# EAGLE board zx81 (EAGLE 7.6.0), part 1 of 9
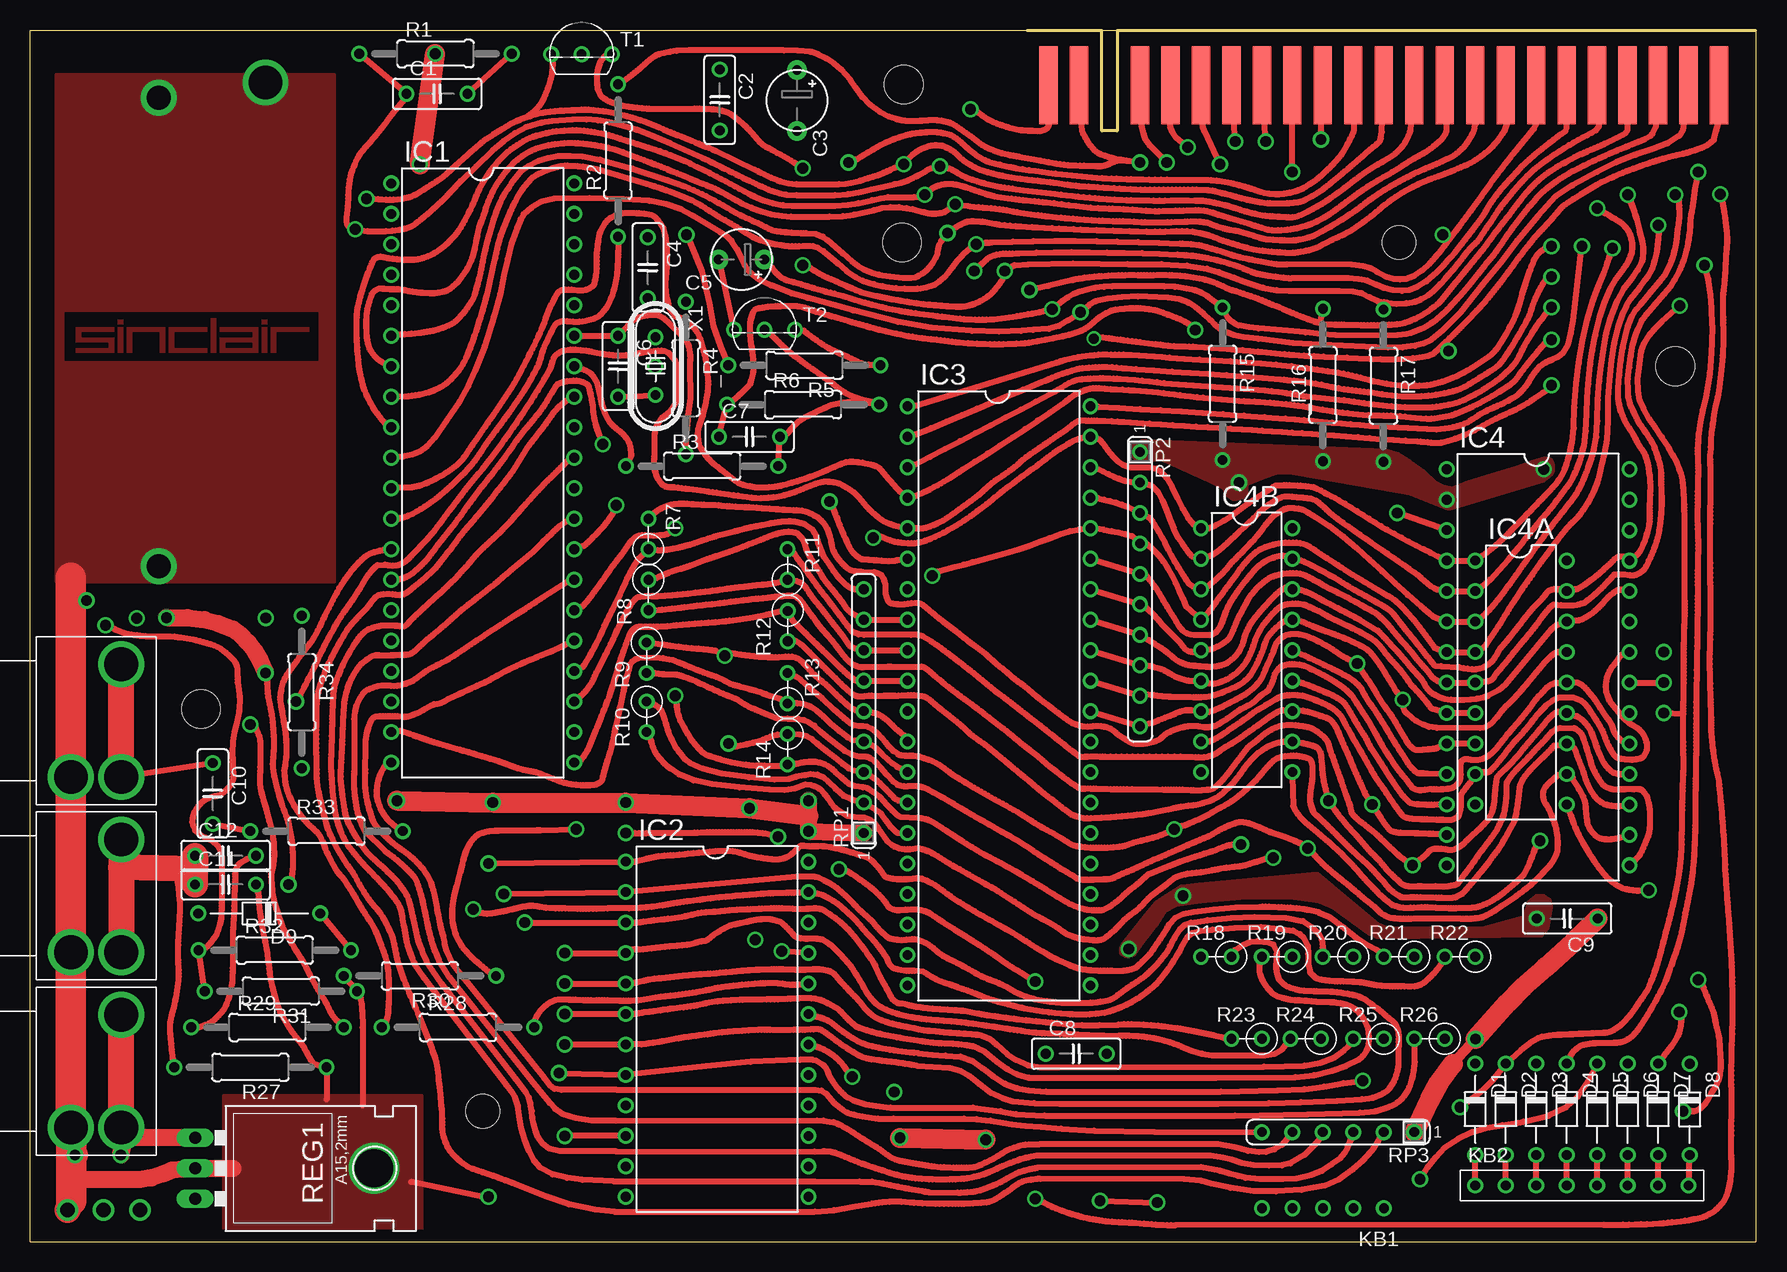
[diagram p1: board, top side]
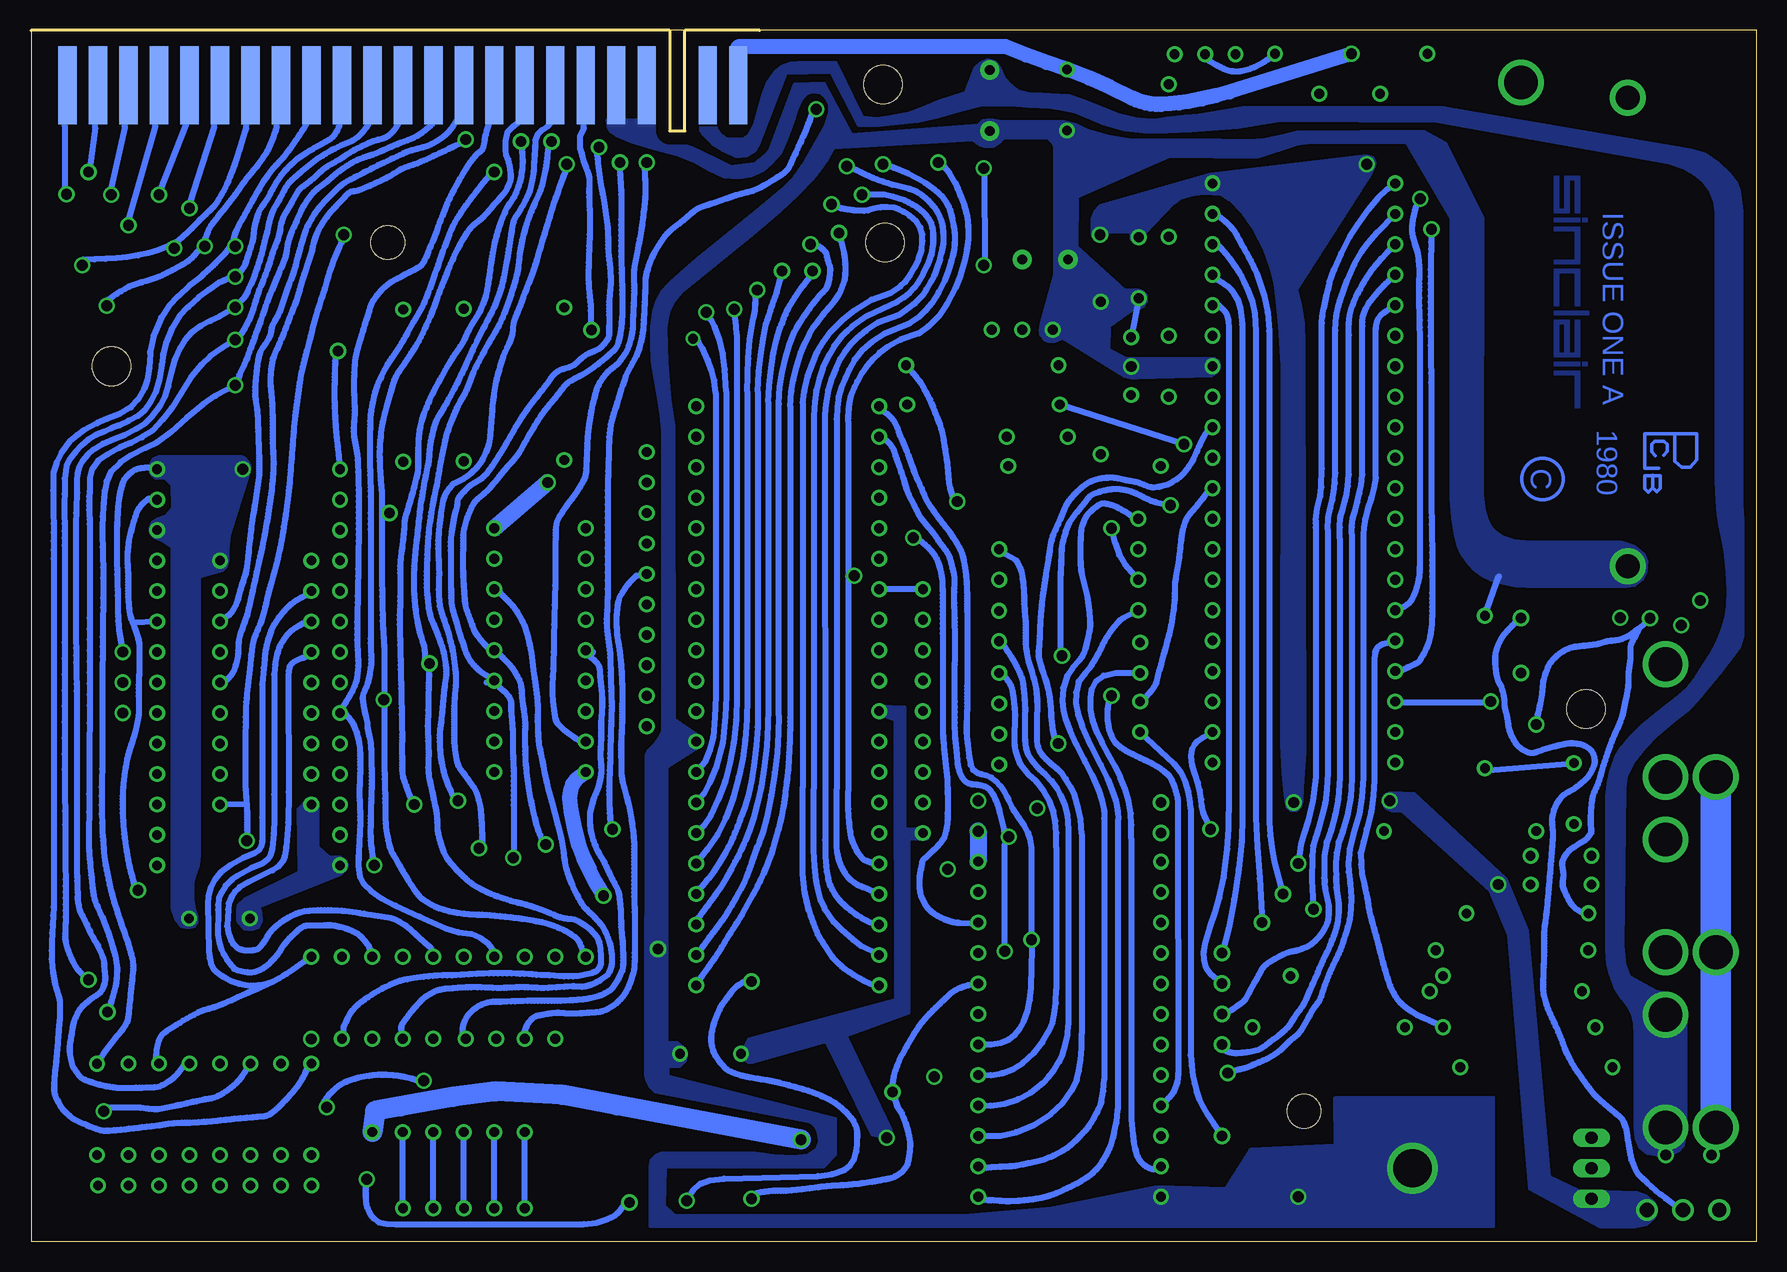
[diagram p2: board, bottom side, seen from below]

Size 143.89 x 100.97 mm. Coordinates in mm from the lower left corner, seen from the top.
Outline: 143.89,100.97 0,100.97 0,0 143.8,0 143.8,100.96
Copper layers (1*16): Top 0.035mm / dielectric 1.5mm / Bottom 0.035mm
Design rules "default *": minimum track width 10mil, minimum drill 24mil, track to track 8mil, track to pad 8mil, pad to pad 8mil, via to via 8mil, smd to smd 8mil, copper to edge 40mil, drill to drill 8mil, minimum pad ring 10mil, minimum via ring 8mil, stop-mask expansion 4mil, vias tented up to drill 0mil, thermal gap 10mil
Holes 3.2 mm at 14.23,44.37 72.81,96.44 72.66,83.27 137.11,72.95
Holes 2.8 mm at 114.09,83.27 37.73,10.88
tRestrict: 4 lines

## Footprints (pad centres in the part's own frame; a part is rotated, then mirrored left to right if it is on the bottom)
R207/12 = drill 0.813: 1 -6.35,0; 2 6.35,0
C025-025X050 = drill 0.813: 1 -2.54,0; 2 2.54,0
E5-5 = drill 0.813 pad 1.6: + -2.54,0; - 2.54,0
E3,8-5 = drill 0.813 pad 1.6: + -1.905,0; - 1.905,0
D10 = drill 0.813: A 3.81,0; C -3.81,0
D15 = drill 0.813: A 5.08,0; C -5.08,0
DIL40 = drill 0.813: 1 -7.62,24.13; 2 -7.62,21.59; 3 -7.62,19.05; 4 -7.62,16.51; 5 -7.62,13.97; 6 -7.62,11.43; 7 -7.62,8.89; 8 -7.62,6.35; 9 -7.62,3.81; 10 -7.62,1.27; 11 -7.62,-1.27; 12 -7.62,-3.81; 13 -7.62,-6.35; 14 -7.62,-8.89; 15 -7.62,-11.43; 16 -7.62,-13.97; 17 -7.62,-16.51; 18 -7.62,-19.05; 19 -7.62,-21.59; 20 -7.62,-24.13; 21 7.62,-24.13; 22 7.62,-21.59; 23 7.62,-19.05; 24 7.62,-16.51; 25 7.62,-13.97; 26 7.62,-11.43; 27 7.62,-8.89; 28 7.62,-6.35; 29 7.62,-3.81; 30 7.62,-1.27; 31 7.62,1.27; 32 7.62,3.81; 33 7.62,6.35; 34 7.62,8.89; 35 7.62,11.43; 36 7.62,13.97; 37 7.62,16.51; 38 7.62,19.05; 39 7.62,21.59; 40 7.62,24.13
DIL24 = drill 0.813: 1 -7.62,13.97; 2 -7.62,11.43; 3 -7.62,8.89; 4 -7.62,6.35; 5 -7.62,3.81; 6 -7.62,1.27; 7 -7.62,-1.27; 8 -7.62,-3.81; 9 -7.62,-6.35; 10 -7.62,-8.89; 11 -7.62,-11.43; 12 -7.62,-13.97; 13 7.62,-13.97; 14 7.62,-11.43; 15 7.62,-8.89; 16 7.62,-6.35; 17 7.62,-3.81; 18 7.62,-1.27; 19 7.62,1.27; 20 7.62,3.81; 21 7.62,6.35; 22 7.62,8.89; 23 7.62,11.43; 24 7.62,13.97
DIL28 = drill 0.813: 1 -7.62,13.97; 2 -7.62,11.43; 3 -7.62,8.89; 4 -7.62,6.35; 5 -7.62,3.81; 6 -7.62,1.27; 7 -7.62,-1.27; 8 -7.62,-3.81; 9 -7.62,-6.35; 10 -7.62,-8.89; 11 -7.62,-11.43; 12 -7.62,-13.97; 13 -7.62,-16.51; 14 -7.62,-19.05; 15 7.62,-19.05; 16 7.62,-16.51; 17 7.62,-13.97; 18 7.62,-11.43; 19 7.62,-8.89; 20 7.62,-6.35; 21 7.62,-3.81; 22 7.62,-1.27; 23 7.62,1.27; 24 7.62,3.81; 25 7.62,6.35; 26 7.62,8.89; 27 7.62,11.43; 28 7.62,13.97
DIL18 = drill 0.813: 1 -3.81,10.16; 2 -3.81,7.62; 3 -3.81,5.08; 4 -3.81,2.54; 5 -3.81,0; 6 -3.81,-2.54; 7 -3.81,-5.08; 8 -3.81,-7.62; 9 -3.81,-10.16; 10 3.81,-10.16; 11 3.81,-7.62; 12 3.81,-5.08; 13 3.81,-2.54; 14 3.81,0; 15 3.81,2.54; 16 3.81,5.08; 17 3.81,7.62; 18 3.81,10.16
ZX81CON = smd 1.524 x 6.477: A1 -27.94,-2.54; A2 -25.4,-2.54; A4 -20.32,-2.54; A5 -17.78,-2.54; A6 -15.24,-2.54; A7 -12.7,-2.54; A8 -10.16,-2.54; A9 -7.62,-2.54; A10 -5.08,-2.54; A11 -2.54,-2.54; A12 0,-2.54; A13 2.54,-2.54; A14 5.08,-2.54; A15 7.62,-2.54; A16 10.16,-2.54; A17 12.7,-2.54; A18 15.24,-2.54; A19 17.78,-2.54; A20 20.32,-2.54; A21 22.86,-2.54; A22 25.4,-2.54; A23 27.94,-2.54 | smd 1.524 x 6.477 bottom: B1 -27.94,-2.54; B2 -25.4,-2.54; B4 -20.32,-2.54; B5 -17.78,-2.54; B6 -15.24,-2.54; B7 -12.7,-2.54; B8 -10.16,-2.54; B9 -7.62,-2.54; B10 -5.08,-2.54; B11 -2.54,-2.54; B12 0,-2.54; B13 2.54,-2.54; B14 5.08,-2.54; B15 7.62,-2.54; B16 10.16,-2.54; B17 12.7,-2.54; B18 15.24,-2.54; B19 17.78,-2.54; B20 20.32,-2.54; B21 22.86,-2.54; B22 25.4,-2.54; B23 27.94,-2.54
ZXKLINKE = drill 2.8: 1 2.1,-4.7; 1' 2.1,4.7; 2 -2.1,-4.7
ZXKDB5 = drill 0.8: P$1 -5.08,0; P$2 -2.54,0; P$3 0,0; P$4 2.54,0; P$5 5.08,0
ZXKBD8 = drill 0.8: P$1 -8.89,0; P$2 -6.35,0; P$3 -3.81,0; P$4 -1.27,0; P$5 1.27,0; P$6 3.81,0; P$7 6.35,0; P$8 8.89,0
RV = drill 0.813: 1 -1.27,0; 2 1.27,0
78XXL = drill 1.016 long: GND 0,0; IN -2.54,0; OUT 2.54,0
SIL9 = drill 0.813: 1 -10.16,0; 2 -7.62,0; 3 -5.08,0; 4 -2.54,0; 5 0,0; 6 2.54,0; 7 5.08,0; 8 7.62,0; 9 10.16,0
SIL10 = drill 0.813: 1 -11.43,0; 2 -8.89,0; 3 -6.35,0; 4 -3.81,0; 5 -1.27,0; 6 1.27,0; 7 3.81,0; 8 6.35,0; 9 8.89,0; 10 11.43,0
SIL6 = drill 0.813: 1 -6.35,0; 2 -3.81,0; 3 -1.27,0; 4 1.27,0; 5 3.81,0; 6 6.35,0
TO92FLAT = drill 0.813: 1 0,0; 2 2.54,0; 3 -2.54,0
HC49 = drill 0.813: 1 -2.413,0; 2 2.413,0

## Placement (x,y rotation side)
_R4  18k  [R207/12]  54.66,71.97 270 top
_R16  [R207/12]  107.75,71.39 90 top
C1  47p  [C025-025X050]  33.92,95.65 0 top
C2  100n  [C025-025X050]  57.47,95.14 270 top
C3  22µ/16V  [E5-5]  63.92,95.1 270 top
C4  100n  [C025-025X050]  51.49,81.16 270 top
C5  1µ  [E3,8-5]  59.29,81.84 180 top
C6  [C025-025X050]  49,72.95 270 top
C7  47p  [C025-025X050]  59.95,67.07 0 top
C8  100n  [C025-025X050]  87.18,15.66 0 top
C9  100n  [C025-025X050]  128.1,26.93 180 top
C10  10n  [C025-025X050]  15.23,37.34 270 top
C11  47n  [C025-025X050]  16.3,29.77 0 top
C12  47p  [C025-025X050]  16.3,32.15 0 top
D1  [D10]  120.44,11.03 270 top
D2  [D10]  122.98,11.03 270 top
D3  [D10]  125.52,11.03 270 top
D4  [D10]  128.06,11.03 270 top
D5  [D10]  130.6,11.03 270 top
D6  [D10]  133.14,11.03 270 top
D7  [D10]  135.68,11.03 270 top
D8  [D10]  138.31,11.02 270 top
D9  [D15]  19.1,27.35 180 top
IC1  ZX81ULA  [DIL40]  37.73,64.06 0 top
IC2  2764  [DIL24]  57.26,17.7 0 top
IC3  Z80CPU  [DIL40]  80.75,45.48 0 top
IC4  4816  [DIL28]  125.68,50.4 0 top
IC4A  2114  [DIL18]  124.25,46.59 0 top
IC4B  2114  [DIL18]  101.39,49.29 0 top
K1  ZX81CONN  [ZX81CON]  112.81,98.9 0 top
K2  MIC  [ZXKLINKE]  5.5,28.81 0 top
K3  EAR  [ZXKLINKE]  5.5,43.42 0 top
K4  DCIN  [ZXKLINKE]  5.5,14.21 0 top
KB1  ZXKBD5CON  [ZXKDB5]  107.74,2.78 180 top
KB2  ZXKBD8CON  [ZXKBD8]  129.33,4.68 0 top
R1  10k  [R207/12]  33.79,98.99 0 top
R2  680  [R207/12]  49,90.09 90 top
R3  not used  [R207/12]  56.01,64.63 0 top
R5  330  [R207/12]  64.53,73.03 180 top
R6  2k2  [R207/12]  64.43,69.76 0 top
R7  470  [RV]  51.54,58.98 270 top
R8  470  [RV]  51.54,53.9 90 top
R9  470  [RV]  51.38,48.66 90 top
R10  470  [RV]  51.38,43.74 90 top
R11  470  [RV]  63.13,56.44 270 top
R12  470  [RV]  63.14,51.29 90 top
R13  470  [RV]  63.13,46.12 270 top
R14  470  [RV]  63.13,41.04 90 top
R15  220k  [R207/12]  99.38,71.49 270 top
R17  1k  [R207/12]  112.79,71.33 270 top
R18  1k  [RV]  98.85,23.73 0 top
R19  1k  [RV]  103.93,23.73 0 top
R20  1k  [RV]  109.01,23.73 0 top
R21  1k  [RV]  114.09,23.73 0 top
R22  1k  [RV]  119.17,23.73 0 top
R23  1k  [RV]  101.39,16.91 0 top
R24  1k  [RV]  106.31,16.91 0 top
R25  1k  [RV]  111.55,16.91 0 top
R26  1k  [RV]  116.63,16.91 0 top
R27  1k  [R207/12]  18.36,14.53 180 top
R28  680  [R207/12]  35.67,17.86 0 top
R29  1M  [R207/12]  19.79,17.86 0 top
R30  [R207/12]  32.49,22.15 180 top
R31  [R207/12]  20.9,20.88 180 top
R32  [R207/12]  20.39,24.29 0 top
R33  4k7  [R207/12]  24.71,34.21 0 top
R34  220  [R207/12]  22.65,45.8 270 top
REG1  7805  [78XXL]  13.76,6.11 270 top
RP1  not used  [SIL9]  69.48,44.21 90 top
RP2  10k  [SIL10]  92.5,54.37 270 top
RP3  RSIL5  [SIL6]  109.01,9.13 180 top
T1  [TO92FLAT]  45.97,98.94 0 top
T2  [TO92FLAT]  61.21,76 0 top
X1  6,5MHz  [HC49]  52.13,72.96 270 top

## Tracks (layer width: path | path; a pad name or v marks a point on that pad's centre or on a via)
+5V  (via drill 0.9, 1.2)
  Top 0.5: v54.72,83.9 55.51,82 55.99,80.88 56.3,79.46 56.62,78.19 56.94,76.28 57.57,74.53 R5.2 | v19.63,47.39 19.76,47.05 19.76,46.86 19.77,46.66 19.77,46.46 19.77,46.27 19.78,46.07 19.79,45.88 19.81,45.68 19.85,45.38 19.9,45.07 19.96,44.77 20.02,44.46 20.09,44.16 20.14,43.86 20.19,43.55 20.22,43.26 20.25,42.97 20.27,42.68 20.29,42.39 20.31,42.1 20.32,41.81 20.33,41.52 20.33,41.23 20.31,40.95 20.29,40.66 20.26,40.38 20.24,40.09 20.23,39.81 20.24,39.53 20.28,39.14 20.35,38.75 20.44,38.37 20.54,37.98 20.64,37.59 20.74,37.21 20.85,36.83 20.94,36.56 21.04,36.29 21.14,36.02 21.24,35.75 21.34,35.48 21.43,35.21 21.51,34.94 21.56,34.72 21.61,34.51 21.65,34.29 21.69,34.08 21.73,33.86 21.77,33.64 21.8,33.43 21.83,33.09 21.86,32.75 21.88,32.41 21.9,32.07 21.91,31.73 21.91,31.39 21.89,31.06 21.88,30.88 21.85,30.69 21.83,30.51 21.8,30.33 21.77,30.14 21.74,29.96 21.7,29.78 v21.54,29.77
  Top 0.813: v120.46,16.89 118.58,14.82
  Top 1.422: v64.88,36.75 64.88,35.48 v64.88,34.21 RP1.1 | v11.38,51.99 13.12,51.99 14.55,51.83 15.66,51.52 16.93,51.04 17.57,50.56 18.2,49.93 18.68,49.29 19.16,48.5 v19.63,47.39
  Top 1.676: v32.49,89.77 v33.76,98.98 | v30.59,36.75 v38.57,36.59 v49.64,36.59 v59.95,36.12 64.88,35.48 | v120.46,16.89 123.14,19.9 124.42,21.18 126.3,22.88 128.63,24.99 C9.1 | 118.58,14.82 117.41,13.24 116.62,11.77 RP3.1 | v72.5,8.65 v79.64,8.49
  Bottom 0.5: IC4.28 133.97,64.5 134.15,64.49 134.34,64.48 134.51,64.47 134.69,64.44 134.86,64.41 135.02,64.36 135.18,64.3 135.32,64.21 135.45,64.11 135.58,64 135.71,63.88 135.84,63.76 135.95,63.63 136.05,63.5 136.11,63.37 136.17,63.23 136.22,63.08 136.26,62.93 136.3,62.78 136.34,62.64 136.38,62.49 136.43,62.26 136.47,62.02 136.49,61.78 136.52,61.54 136.54,61.3 136.56,61.06 136.58,60.82 136.6,60.6 136.61,60.38 136.62,60.16 136.63,59.94 136.63,59.72 136.64,59.5 136.65,59.28 136.65,58.94 136.66,58.59 136.66,58.25 136.66,57.9 136.65,57.56 136.65,57.21 136.65,56.87 136.64,56.44 136.63,56.01 136.62,55.58 136.61,55.15 136.6,54.72 136.59,54.29 136.58,53.86 136.57,53.5 136.57,53.15 136.57,52.8 136.56,52.44 136.56,52.09 136.54,51.73 136.51,51.38 136.49,51.13 136.45,50.88 136.42,50.63 136.38,50.39 136.33,50.14 136.29,49.89 136.25,49.64 v136.16,49.13
  Bottom 1.27: v33.76,98.98 43.92,95.82 arc8 47.4,95.01 arc7 49.66,94.78 arc30 52.1,95.32 arc-8 C2.1 arc5 62.59,99.59 84.9,99.56 K1.B1
  Bottom 1.422: IC4B.18 v100.75,63.26 | v64.88,34.21 IC2.24
  Bottom 1.676: v79.64,8.49 94.95,11.35 99.55,12.22 105.08,12.52 108.62,12.07 113.03,11.28 115.14,10.9 RP3.1
  other vias: 126.15,64.37 9.15,2.62
  pour Top (no thermals): 92.97,66.75 112.98,65.96 113.93,65.64 115.04,65.01 116.15,64.22 117.11,63.26 117.74,62.94 118.53,62.79 119.8,63.26 121.87,63.9 123.93,64.53 125.2,65.01 126.31,65.33 126.79,65.17 126.95,64.69 126.95,64.22 126.79,63.9 126.15,63.42 118.22,61.04 115.04,62.31 105.99,63.9 104.88,64.06 103.93,64.06 102.98,63.74 101.39,63.1 101.39,62.31 101.07,61.99 100.28,61.83 99.8,62.15 99.48,62.79 98.21,63.42 94.72,65.01 94.25,65.17 93.61,65.17 92.66,65.17 92.18,65.17 91.86,65.49 91.7,65.8 91.7,66.12 92.02,66.44 92.66,66.75
  pour Bottom (no thermals): 73.14,44.63 70.97,44.52 70.97,34.37 69.13,34.37 69.13,33.56 70.65,33.56 70.65,19.07 75.91,17.17 72.17,9.3 72.44,8.65 73.69,8.92 77.54,16.68 83.88,14.89 84.7,15.44 83.99,16.85 71.73,20.16 71.79,43.49 73.25,43.97 73.15,44.62 72.11,44.19
  pour Bottom (no thermals): 13.72,4.19 9.99,4.08 9.19,3.79 8.58,3.29 8.38,2.66 8.53,1.98 9.17,1.44 10.17,1.24 13.02,1.22 18.93,4.43 20.65,25.58 22.22,29.22 29.58,35.89 30.41,35.89 30.89,36.13 31.1,36.57 31.1,36.94 30.84,37.28 30.41,37.41 28.56,37.31 20.91,30.22 19.1,25.89 17.29,5.43 14.81,4.23 13.74,4.21
  pour Bottom (no thermals): 32.52,90.49 45.51,88.94 54.7,86.31 55.11,85.85 55.38,85.21 55.38,83.97 55.07,83.48 54.55,83.41 54.25,83.67 54.06,84.16 52.1,84.16 52.1,83.56 51.8,83.33 51.35,83.29 51.08,83.56 51.04,83.97 48.71,86.46 47.96,86.98 47.05,87.25 46.11,87.36 44.57,87.28 43.89,86.83 42.83,85.74 41.86,84.35 40.99,82.69 40.42,81.03 40.12,79.83 39.94,78.4 39.75,76.29 39.52,72.97 39.56,41.45 39.46,39.04 39.28,37.25 39.13,36.2 38.81,35.95 38.31,35.95 38.05,36.28 37.91,36.68 37.87,37.83 37.77,39.07 37.68,40.77 37.73,74.81 37.79,76.59 38.05,78.09 38.35,79.38 32.14,89.13 31.8,89.92 31.99,90.34
  pour Bottom (no thermals): 126.24,65.41 133.15,65.39 133.61,65.2 133.87,64.72 133.89,64.33 133.8,63.98 133.43,63.67 132.6,63.63 132.04,63.04 131.99,61.12 132.58,60.45 133.15,60.23 133.72,59.9 133.87,59.44 133.82,59.07 133.52,58.7 132.93,58.44 132.02,57.85 132.04,27.78 131.69,26.83 131.28,26.3 130.73,26.15 130.21,26.28 129.99,26.59 129.99,27.11 130.21,27.72 130.32,28.52 130.32,29.96 130.1,30.7 129.86,31.36 129.77,32.16 129.79,55.39 127.83,55.94 127.59,56.2 127.4,56.74 127.4,57.64 127.27,58.92 125.68,64.09 125.59,64.61 125.72,64.96 125.98,65.28
/BUSAK  (via drill 0.9)
  Top 0.5: K1.A18 128.06,92.79 127.94,92.54 127.61,92.3 127.29,92.06 126.96,91.82 126.64,91.58 126.32,91.33 126,91.08 125.69,90.82 125.5,90.66 125.3,90.5 125.11,90.33 124.92,90.16 124.73,89.99 124.55,89.82 124.37,89.64 124.23,89.5 124.09,89.36 123.96,89.21 123.83,89.07 123.7,88.92 123.57,88.78 123.44,88.63 123.29,88.47 123.14,88.31 123,88.15 122.85,87.99 122.7,87.83 122.56,87.67 122.42,87.5 122.31,87.35 122.19,87.2 122.08,87.04 121.96,86.89 121.85,86.73 121.74,86.57 121.64,86.41 121.57,86.29 121.5,86.18 121.43,86.06 121.36,85.94 121.3,85.82 121.23,85.71 121.16,85.59 121.07,85.46 120.97,85.32 120.88,85.19 120.78,85.06 120.68,84.93 120.58,84.8 120.48,84.66 120.19,84.28 119.9,83.9 119.61,83.53 119.31,83.15 119.02,82.78 118.71,82.41 118.4,82.05 118.2,81.83 118,81.61 117.81,81.38 117.61,81.16 117.4,80.95 117.19,80.75 116.36,80.02 115.57,79.55 114.96,79.3 114.33,79.22 113.57,79.3 112.78,79.49 112.21,79.75 111.47,80.06 110.72,80.22 109.86,80.3 105.1,80.28 104.88,80.29 104.67,80.31 104.45,80.34 104.23,80.36 104.01,80.39 103.8,80.41 103.58,80.44 103.36,80.47 103.14,80.51 102.92,80.54 102.71,80.58 102.49,80.62 102.28,80.67 102.03,80.74 101.78,80.83 101.54,80.93 101.3,81.03 101.05,81.13 100.81,81.23 100.56,81.31 100.3,81.4 100.03,81.48 99.76,81.56 99.49,81.64 99.22,81.71 98.95,81.78 98.68,81.85 98.43,81.9 98.18,81.95 97.93,82 97.68,82.05 97.43,82.09 97.18,82.13 96.93,82.16 96.74,82.18 96.55,82.19 96.37,82.2 96.18,82.21 95.99,82.22 95.8,82.23 95.61,82.24 94.14,82.32 92.68,82.37 91.21,82.4 89.75,82.43 88.28,82.44 86.81,82.45 85.34,82.44 83.88,82.41 82.41,82.36 82.15,82.34 81.88,82.34 81.61,82.34 81.34,82.34 81.08,82.32 80.81,82.3 80.55,82.24 80.47,82.22 80.38,82.19 80.28,82.16 80.19,82.13 80.1,82.1 80.02,82.06 79.94,82.02 79.87,81.97 79.81,81.92 79.75,81.87 79.69,81.82 79.63,81.76 79.57,81.71 79.49,81.63 79.41,81.56 79.33,81.48 79.25,81.41 79.17,81.33 79.09,81.25 79.01,81.17 v78.69,80.88
  Bottom 0.5: v78.69,80.88 78.95,80.34 79.12,80.12 79.3,79.89 79.47,79.66 79.64,79.43 79.81,79.2 79.97,78.97 80.13,78.73 80.24,78.57 80.34,78.4 80.45,78.23 80.55,78.06 80.65,77.89 80.75,77.72 80.84,77.55 80.93,77.36 81,77.18 81.08,76.99 81.15,76.8 81.22,76.6 81.29,76.41 81.36,76.22 81.66,75.25 81.94,74 82.17,72.44 82.29,71.34 82.36,69.94 82.36,44.44 82.39,43.04 82.49,41.28 82.68,39.62 82.95,37.9 83.27,36.49 83.56,35.36 83.86,34.51 83.97,34.24 84.07,33.97 84.17,33.69 84.28,33.43 84.39,33.16 84.53,32.86 84.67,32.56 84.81,32.26 84.97,31.96 85.12,31.67 85.28,31.37 85.43,31.08 85.55,30.87 85.67,30.65 85.79,30.44 85.91,30.23 86.03,30.02 86.16,29.82 86.28,29.61 86.41,29.42 86.53,29.24 86.66,29.06 86.79,28.88 86.92,28.7 87.05,28.52 87.18,28.33 87.32,28.14 87.46,27.95 87.61,27.76 87.75,27.57 87.89,27.39 88.03,27.2 88.18,27.01 IC3.23
/BUSRQ  (via drill 0.9)
  Top 0.5: 107.46,76.56 107.34,76.6 107.23,76.63 107.11,76.67 106.97,76.72 106.82,76.77 106.68,76.82 106.53,76.87 106.39,76.93 106.24,76.98 106.1,77.03 105.82,77.14 105.53,77.26 105.25,77.38 104.97,77.5 104.69,77.61 104.41,77.73 104.13,77.85 103.83,77.97 103.54,78.09 103.24,78.22 102.94,78.34 102.65,78.46 102.35,78.58 102.05,78.69 101.74,78.8 101.43,78.91 101.12,79.01 100.81,79.11 100.5,79.21 100.19,79.3 99.88,79.4 99.64,79.51 99.41,79.62 99.17,79.73 98.93,79.83 98.69,79.93 98.44,80.02 98.19,80.1 97.95,80.16 97.71,80.22 97.46,80.27 97.22,80.32 96.97,80.36 96.72,80.4 96.48,80.44 96.26,80.46 96.04,80.48 95.83,80.5 95.61,80.51 95.39,80.53 95.17,80.54 94.96,80.55 94.69,80.56 94.43,80.56 94.16,80.56 93.9,80.56 93.63,80.55 93.37,80.55 93.1,80.55 92.84,80.55 92.58,80.55 92.32,80.55 92.05,80.55 91.79,80.56 91.53,80.55 91.27,80.55 90.99,80.54 90.71,80.53 90.43,80.52 90.14,80.51 89.86,80.5 89.58,80.49 89.3,80.47 89.1,80.45 88.9,80.43 88.7,80.41 88.5,80.4 88.3,80.37 88.09,80.35 87.89,80.32 87.74,80.3 87.58,80.28 87.42,80.26 87.26,80.23 87.11,80.2 86.95,80.17 86.8,80.13 85.92,79.91 84.89,79.65 v83.29,79.3 | 107.46,76.56 107.58,76.53 107.69,76.5 107.81,76.47 107.93,76.44 108.12,76.44 108.31,76.43 108.51,76.43 108.7,76.43 108.89,76.42 109.09,76.42 109.28,76.41 109.51,76.41 109.75,76.41 109.98,76.4 110.21,76.4 110.44,76.39 110.68,76.39 110.91,76.39 111.19,76.38 111.46,76.38 111.73,76.38 112,76.37 112.28,76.37 112.55,76.38 112.83,76.39 113.05,76.4 113.27,76.41 113.49,76.42 113.72,76.44 113.94,76.46 114.16,76.49 114.37,76.53 114.57,76.58 114.76,76.64 114.95,76.71 115.14,76.79 115.33,76.87 115.51,76.95 115.69,77.03 115.97,77.18 116.23,77.35 116.49,77.53 116.74,77.71 116.99,77.9 117.24,78.09 117.47,78.3 117.65,78.49 117.82,78.69 117.99,78.9 118.15,79.11 118.32,79.32 118.48,79.53 118.65,79.73 118.82,79.94 118.99,80.14 119.16,80.34 119.33,80.54 119.5,80.74 119.66,80.94 119.83,81.14 120.02,81.37 120.2,81.6 120.39,81.82 120.58,82.05 120.76,82.28 120.94,82.51 121.12,82.75 121.3,82.98 121.47,83.21 121.64,83.44 121.82,83.68 121.99,83.91 122.16,84.15 122.33,84.38 122.47,84.55 122.61,84.72 122.74,84.9 122.88,85.07 123.02,85.24 123.16,85.41 123.29,85.59 123.5,85.85 123.7,86.12 123.9,86.39 124.1,86.66 124.3,86.93 124.51,87.19 124.73,87.44 124.88,87.61 125.04,87.78 125.2,87.94 125.36,88.1 125.52,88.26 125.68,88.42 125.85,88.57 126.07,88.75 126.29,88.92 126.52,89.08 126.75,89.24 126.98,89.39 127.22,89.54 127.46,89.69 127.71,89.83 127.96,89.97 128.21,90.1 128.46,90.24 128.72,90.37 128.97,90.5 129.23,90.62 129.51,90.75 129.8,90.88 130.08,91 130.37,91.12 130.66,91.24 130.94,91.37 131.23,91.5 131.48,91.62 131.73,91.74 131.98,91.86 132.23,91.99 132.48,92.11 132.72,92.24 132.97,92.37 133.14,92.63 K1.A20
  Top 0.5: _R16.2 107.46,76.56
  Bottom 0.5: v83.29,79.3 83.44,78.64 83.45,78.45 83.46,78.27 83.47,78.09 83.48,77.9 83.49,77.72 83.51,77.54 83.54,77.36 83.58,77.15 83.64,76.94 83.92,75.17 84.02,73.6 84.11,70.81 84.11,45.31 84.15,43.48 84.3,41.84 84.49,40.23 84.84,38.71 85.3,37 85.91,35.29 86.6,33.94 87.45,32.7 IC3.25
/HALT  (via drill 0.9)
  Top 0.5: R1.1 C1.1 31.26,95.28 31.07,95.03 30.85,94.77 30.64,94.52 30.43,94.27 30.24,94.02 30,93.7 29.75,93.38 29.5,93.07 29.25,92.75 29,92.44 28.75,92.12 28.5,91.81 28.35,91.63 28.19,91.45 28.03,91.28 27.87,91.1 27.71,90.92 27.56,90.73 27.43,90.54 27.3,90.31 27.18,90.06 27.06,89.82 26.96,89.56 26.86,89.31 26.77,89.06 26.69,88.8 26.63,88.49 26.59,88.18 26.56,87.86 26.54,87.55 26.52,87.23 26.5,86.91 26.49,86.59 26.47,86.3 26.44,85.98 26.4,85.66 26.37,85.33 26.36,85.03 26.41,84.77 26.56,84.58 26.62,84.55 26.7,84.52 v27.09,84.38 27.59,84.27 28.1,84.21 28.63,84.19 29.15,84.19 29.68,84.21 30.2,84.25 30.71,84.32 30.83,84.34 30.96,84.36 31.09,84.39 31.21,84.42 31.34,84.44 31.46,84.48 31.58,84.52 31.78,84.62 31.98,84.74 32.17,84.87 32.36,85.02 32.55,85.16 32.73,85.31 32.92,85.45 33.16,85.65 33.39,85.86 33.62,86.07 33.85,86.28 34.07,86.5 34.3,86.71 34.52,86.93 34.76,87.16 34.98,87.4 35.21,87.64 35.44,87.89 35.66,88.13 35.89,88.37 37.17,89.61 38.54,90.92 39.47,91.71 40.43,92.38 41.35,92.87 42.61,93.24 43.51,93.38 45.2,93.5 46.36,93.52 47.32,93.44 48.27,93.28 49.19,93.03 50.56,92.65 51.8,92.16 53.39,91.51 56.04,90.32 56.33,90.19 56.56,90.08 56.79,89.97 57.02,89.85 57.25,89.74 57.48,89.62 57.71,89.5 57.94,89.39 58.23,89.24 58.52,89.1 58.81,88.96 59.1,88.81 59.39,88.67 59.68,88.53 59.97,88.39 60.23,88.27 60.49,88.15 60.75,88.03 61.01,87.91 61.27,87.79 61.53,87.68 61.79,87.56 62.46,87.36 63.01,87.25 63.87,87.2 67.1,87.2 68.15,87.29 69.25,87.47 70.09,87.68 71.11,87.9 72.02,88.12 72.58,88.24 73.2,88.46 73.4,88.56 73.59,88.65 73.78,88.75 73.97,88.84 74.17,88.94 74.35,89.03 74.52,89.13 74.7,89.24 74.87,89.35 75.05,89.45 75.23,89.53 v75.83,89.62 76.29,89.51 76.4,89.48 76.52,89.45 76.63,89.41 76.83,89.33 77.02,89.23 77.2,89.12 77.39,89.01 77.57,88.9 77.76,88.79 77.95,88.7 78.14,88.63 78.33,88.56 78.52,88.49 78.72,88.43 78.91,88.37 79.11,88.31 79.3,88.25 79.49,88.2 79.67,88.16 79.86,88.11 80.04,88.07 80.23,88.02 80.42,87.98 80.6,87.94 80.92,87.88 81.23,87.83 81.54,87.79 81.86,87.74 82.17,87.7 82.49,87.66 82.8,87.61 83.18,87.56 83.55,87.52 83.93,87.47 84.3,87.43 84.68,87.39 85.05,87.35 85.43,87.31 85.91,87.25 86.38,87.2 86.86,87.14 87.33,87.09 87.81,87.04 88.29,86.99 88.77,86.95 89.08,86.93 89.4,86.9 89.72,86.88 90.04,86.86 90.35,86.84 90.67,86.82 90.99,86.81 91.36,86.8 91.74,86.79 92.11,86.78 92.49,86.77 92.87,86.77 93.24,86.77 93.62,86.76 94.11,86.76 94.6,86.76 95.09,86.76 95.58,86.77 96.07,86.77 96.56,86.77 97.05,86.76 97.16,86.76 97.28,86.76 97.39,86.75 97.51,86.75 97.62,86.75 97.74,86.75 97.85,86.74 98,86.72 98.14,86.69 98.28,86.67 98.42,86.64 98.56,86.61 98.7,86.58 98.84,86.55 99,86.51 99.16,86.48 99.31,86.44 99.47,86.41 99.62,86.37 99.78,86.33 99.93,86.29 100.11,86.24 100.29,86.18 100.47,86.12 100.65,86.06 100.83,86 101.01,85.94 101.19,85.88 101.41,85.83 101.62,85.77 101.84,85.72 102.06,85.66 102.28,85.61 102.5,85.57 102.73,85.53 102.93,85.5 103.13,85.48 103.33,85.47 103.54,85.45 103.74,85.44 103.94,85.42 104.14,85.41 104.33,85.4 104.5,85.39 104.69,85.38 104.87,85.37 105.05,85.36 105.22,85.37 105.4,85.39 105.57,85.43 105.74,85.5 105.9,85.57 106.07,85.65 106.23,85.73 106.4,85.81 106.56,85.88 106.75,85.98 106.94,86.08 107.12,86.19 107.31,86.29 107.5,86.4 107.68,86.51 107.86,86.62 108.06,86.75 108.25,86.88 108.44,87.02 108.64,87.15 108.83,87.29 109.02,87.43 109.21,87.56 109.36,87.68 109.51,87.79 109.66,87.9 109.8,88.01 109.95,88.12 110.1,88.24 110.25,88.35 110.39,88.46 110.54,88.56 110.68,88.67 110.83,88.78 110.97,88.89 111.12,89 111.27,89.1 111.38,89.18 111.5,89.26 111.62,89.34 111.74,89.42 111.86,89.5 111.97,89.57 112.1,89.65 112.22,89.72 112.34,89.79 112.47,89.86 112.6,89.93 112.72,90 112.85,90.07 112.97,90.14 113.1,90.23 113.23,90.31 113.37,90.4 113.5,90.48 113.62,90.57 113.75,90.66 113.87,90.76 113.96,90.84 114.05,90.93 114.14,91.02 114.22,91.11 114.3,91.21 114.39,91.3 114.46,91.4 114.57,91.56 114.67,91.72 114.75,91.89 114.83,92.06 114.91,92.24 114.98,92.42 115.05,92.6 K1.A13
  Bottom 0.5: v27.09,84.38 27.11,83.86 27.12,83.29 27.13,82.71 27.14,82.14 27.15,81.57 27.16,80.99 27.17,80.42 27.18,79.84 27.18,79.33 27.18,78.81 27.18,78.3 27.18,77.78 27.18,77.26 27.18,76.75 27.18,76.23 27.17,75.46 27.16,74.69 27.15,73.92 27.14,73.15 27.13,72.38 27.12,71.61 27.11,70.84 27.11,70.07 27.11,69.44 27.11,68.81 27.11,68.18 27.11,67.55 27.11,66.92 27.11,66.29 27.11,65.66 27.11,65.06 27.11,64.47 27.11,63.88 27.11,63.29 27.11,62.69 27.11,62.1 27.11,61.51 27.1,60.92 27.1,60.34 27.09,59.75 27.08,59.17 27.06,58.58 27.05,58 27.05,57.41 27.04,56.82 27.04,56.36 27.04,55.91 27.04,55.45 27.04,54.99 27.04,54.53 27.04,54.07 27.04,53.61 27.05,53.26 27.05,52.9 27.05,52.55 27.05,52.19 27.06,51.84 27.07,51.49 27.11,51.13 27.13,50.97 27.16,50.81 27.18,50.64 27.2,50.48 27.23,50.32 27.27,50.16 27.31,50 27.35,49.88 27.39,49.76 27.44,49.65 27.49,49.53 27.54,49.42 27.59,49.31 27.64,49.19 27.72,49.05 27.8,48.91 27.88,48.77 27.96,48.63 28.04,48.49 28.14,48.37 28.25,48.26 28.33,48.2 28.43,48.15 28.52,48.1 28.62,48.06 28.72,48.01 28.82,47.97 28.92,47.92 29.03,47.87 29.15,47.81 29.26,47.75 29.38,47.69 29.49,47.64 29.61,47.58 29.72,47.52 IC1.17 | v75.83,89.62 75.27,89.4 75.13,89.34 74.99,89.27 74.85,89.2 74.71,89.13 74.58,89.07 74.44,89 74.31,88.94 74.19,88.89 74.06,88.83 73.94,88.77 73.82,88.71 73.69,88.66 73.57,88.6 73.41,88.54 73.24,88.48 73.08,88.42 72.92,88.37 72.75,88.31 72.59,88.26 72.43,88.2 72.21,88.12 71.99,88.05 70.65,87.73 69.99,87.48 69.84,87.38 69.69,87.28 69.54,87.18 69.4,87.07 69.26,86.96 69.13,86.84 69,86.72 68.88,86.59 68.76,86.47 68.64,86.33 68.53,86.2 68.42,86.06 68.37,85.97 68.32,85.89 68.27,85.81 68.22,85.72 68.18,85.63 68.13,85.54 68.09,85.46 68.05,85.36 68.01,85.27 67.98,85.17 67.94,85.08 67.91,84.98 67.88,84.88 67.86,84.79 67.83,84.65 67.81,84.51 67.79,84.37 67.78,84.23 67.77,84.09 67.76,83.96 67.75,83.82 67.75,83.74 67.75,83.65 67.75,83.57 67.75,83.49 67.75,83.41 67.75,83.33 67.75,83.25 67.77,83.11 67.79,82.97 67.82,82.83 67.85,82.69 67.89,82.55 67.92,82.41 67.95,82.28 68,82.12 68.05,81.96 68.36,81.01 68.55,80.5 68.82,80 69.21,79.33 69.55,78.82 70.16,78.19 70.72,77.76 71.5,77.2 73.25,76.56 74.23,75.9 74.98,75.3 75.49,74.79 75.96,74.2 76.39,73.57 76.74,72.74 77.08,71.94 77.39,70.99 77.56,69.8 77.64,68.87 77.63,33.47 77.61,32.11 77.56,31.25 77.51,30.84 77.37,30.24 77.33,30.11 77.29,29.97 77.25,29.84 77.2,29.7 77.15,29.58 77.07,29.42 76.99,29.27 76.9,29.12 76.81,28.97 76.71,28.82 76.62,28.67 76.51,28.54 76.43,28.44 76.34,28.35 76.25,28.26 76.16,28.17 76.06,28.08 75.97,27.99 75.88,27.9 75.76,27.8 75.63,27.7 75.51,27.6 75.39,27.51 75.26,27.42 75.13,27.32 75,27.23 74.85,27.13 74.7,27.04 74.54,26.95 74.38,26.86 74.22,26.77 74.06,26.68 73.9,26.6 IC3.18
/IORQ  (via drill 0.9)
  Top 0.5: IC1.7 29.57,73.15 29.47,73.21 29.38,73.27 29.28,73.33 29.18,73.39 29.09,73.46 29,73.53 28.91,73.6 28.81,73.7 28.72,73.8 28.63,73.91 28.54,74.03 28.46,74.14 28.39,74.26 28.32,74.38 28.28,74.49 28.24,74.59 28.21,74.71 28.18,74.82 28.16,74.93 28.13,75.05 28.11,75.16 28.08,75.33 28.07,75.5 28.06,75.66 28.05,75.84 28.04,76 28.04,76.17 28.04,76.34 28.04,76.51 28.04,76.68 28.04,76.84 28.04,77.01 28.05,77.17 28.06,77.34 28.08,77.5 28.11,77.65 28.14,77.8 28.18,77.94 28.21,78.09 28.25,78.24 28.29,78.38 28.34,78.52 28.38,78.62 28.42,78.72 28.45,78.82 28.49,78.92 28.54,79.02 28.59,79.11 28.65,79.18 28.71,79.23 28.78,79.28 28.85,79.32 28.93,79.36 29,79.39 29.08,79.42 29.16,79.43 29.23,79.43 29.32,79.43 29.4,79.42 29.48,79.41 29.56,79.4 29.64,79.4 29.82,79.39 30,79.39 30.17,79.38 30.35,79.38 30.53,79.38 30.7,79.37 30.88,79.35 31,79.33 31.12,79.31 31.24,79.29 31.36,79.26 31.48,79.24 31.61,79.21 31.73,79.18 31.89,79.16 32.05,79.14 32.21,79.12 32.38,79.1 32.54,79.09 32.7,79.07 32.86,79.06 33.01,79.06 33.15,79.05 33.3,79.05 33.45,79.05 33.59,79.05 33.74,79.05 33.88,79.06 34.02,79.09 34.16,79.11 34.3,79.14 34.43,79.17 34.57,79.21 34.7,79.25 34.83,79.3 34.96,79.38 35.09,79.47 35.21,79.57 35.33,79.68 35.45,79.79 35.57,79.9 35.68,80.01 35.8,80.15 35.91,80.28 36.02,80.43 36.12,80.58 36.22,80.73 36.32,80.88 36.41,81.03 36.49,81.18 36.57,81.32 36.64,81.48 36.72,81.63 36.78,81.78 36.85,81.94 36.91,82.09 36.96,82.25 37,82.41 37.03,82.57 37.07,82.74 37.1,82.9 37.13,83.07 37.17,83.23 37.21,83.41 37.24,83.59 37.27,83.77 37.31,83.95 37.34,84.13 37.38,84.31 37.43,84.48 37.47,84.61 37.52,84.74 37.57,84.86 37.62,84.98 37.67,85.11 37.71,85.23 37.76,85.36 37.82,85.54 37.88,85.72 37.94,85.91 38,86.09 38.06,86.27 38.12,86.46 38.19,86.64 38.26,86.82 38.34,87.01 38.42,87.19 38.51,87.38 38.59,87.56 38.68,87.74 38.78,87.91 38.88,88.09 38.99,88.25 39.11,88.42 39.22,88.59 39.34,88.75 39.46,88.91 39.58,89.07 39.7,89.21 39.81,89.34 39.93,89.48 40.05,89.61 40.17,89.74 40.29,89.87 40.41,90 40.61,90.15 40.81,90.31 41.01,90.46 41.21,90.6 41.42,90.74 41.63,90.86 41.85,90.97 42.01,91.03 42.16,91.09 42.32,91.14 42.48,91.19 42.64,91.23 42.8,91.28 42.97,91.32 43.22,91.38 43.48,91.42 43.74,91.46 44,91.49 44.27,91.52 44.53,91.54 44.79,91.56 45,91.56 45.22,91.56 45.44,91.55 45.65,91.54 45.87,91.52 46.09,91.51 46.3,91.49 46.45,91.47 46.61,91.45 46.76,91.42 46.91,91.4 47.06,91.37 47.22,91.35 47.37,91.32 47.56,91.28 47.76,91.24 47.96,91.2 48.16,91.16 48.35,91.11 48.55,91.07 48.74,91.01 48.97,90.94 49.19,90.87 49.41,90.78 49.63,90.7 49.86,90.61 50.08,90.53 50.3,90.45 50.59,90.34 50.88,90.23 51.16,90.12 51.45,90.02 51.74,89.91 52.03,89.8 52.31,89.69 52.58,89.58 52.85,89.47 53.12,89.37 53.38,89.26 53.65,89.15 53.91,89.04 54.18,88.93 54.39,88.85 54.59,88.76 54.8,88.68 55.01,88.59 55.21,88.51 55.42,88.43 55.62,88.34 55.87,88.24 56.11,88.14 56.36,88.04 56.6,87.95 56.85,87.85 57.09,87.74 57.33,87.63 57.52,87.53 57.72,87.42 57.91,87.31 58.1,87.2 58.29,87.09 58.48,86.98 58.68,86.87 58.9,86.75 59.13,86.62 59.35,86.49 60.12,86.17 60.92,85.84 61.78,85.61 62.67,85.47 63.42,85.42 66.64,85.42 67.74,85.46 68.66,85.59 69.36,85.73 70.34,85.96 71,86.15 71.7,86.22 72.41,86.22 73.02,86.13 73.55,86.05 74.49,85.8 74.64,85.75 74.8,85.71 74.96,85.68 75.12,85.67 75.26,85.66 75.39,85.67 75.53,85.68 75.67,85.69 75.81,85.7 75.94,85.72 76.07,85.76 76.16,85.8 76.25,85.84 76.34,85.89 76.43,85.94 v77.1,86.44 77.5,86.37 78.16,86.32 78.34,86.28 78.69,86.24 79.03,86.2 79.38,86.17 79.73,86.15 80.08,86.12 80.43,86.09 80.78,86.05 81.07,86 81.37,85.95 81.66,85.9 81.95,85.84 82.25,85.79 82.54,85.74 82.83,85.69 83.13,85.65 83.42,85.61 83.72,85.57 84.01,85.53 84.3,85.5 84.6,85.46 84.89,85.43 85.23,85.39 85.56,85.36 85.9,85.33 86.23,85.3 86.57,85.27 86.9,85.24 87.24,85.22 87.54,85.19 87.85,85.17 88.16,85.15 88.47,85.13 88.77,85.11 89.08,85.09 89.39,85.07 89.67,85.06 89.96,85.06 90.24,85.05 90.53,85.05 90.81,85.04 91.09,85.03 91.38,85.03 91.68,85.02 91.99,85 92.3,84.98 92.61,84.97 92.92,84.95 93.22,84.94 93.53,84.93 93.85,84.93 94.17,84.94 94.48,84.94 94.8,84.96 95.12,84.97 95.44,84.97 95.75,84.98 95.99,84.99 96.23,84.99 96.47,85 96.72,85.01 96.95,85.02 97.19,85.02 97.43,85 97.53,84.99 97.64,84.98 97.74,84.97 97.84,84.96 97.94,84.94 98.04,84.93 98.14,84.91 98.32,84.84 98.5,84.77 98.68,84.7 98.86,84.63 99.03,84.57 99.22,84.51 99.4,84.46 99.57,84.41 99.75,84.38 99.92,84.34 100.1,84.31 100.27,84.28 100.45,84.25 100.63,84.22 100.77,84.18 100.91,84.14 101.05,84.1 101.2,84.06 101.34,84.02 101.48,83.98 101.62,83.94 101.79,83.89 101.95,83.84 102.12,83.78 102.28,83.72 102.45,83.67 102.61,83.62 102.78,83.58 102.97,83.55 103.17,83.53 103.37,83.51 103.56,83.5 103.76,83.49 103.96,83.47 104.15,83.47 104.35,83.46 104.54,83.45 104.73,83.45 104.93,83.44 105.12,83.44 105.31,83.45 105.5,83.47 105.69,83.49 105.89,83.53 106.08,83.57 106.27,83.61 106.46,83.66 106.64,83.71 106.83,83.77 107.01,83.85 107.18,83.93 107.35,84.03 107.52,84.12 107.69,84.22 107.86,84.32 108.03,84.41 108.23,84.52 108.42,84.64 108.62,84.75 108.81,84.87 109,84.98 109.19,85.1 109.38,85.22 109.57,85.34 109.75,85.46 109.93,85.58 110.12,85.7 110.3,85.82 110.48,85.94 110.66,86.07 110.85,86.21 111.04,86.35 111.23,86.49 111.42,86.64 111.6,86.78 111.79,86.93 111.98,87.06 112.16,87.18 112.33,87.29 112.5,87.4 112.67,87.52 112.84,87.63 113.02,87.74 113.19,87.84 113.38,87.95 113.57,88.06 113.76,88.16 113.95,88.27 114.14,88.37 114.33,88.47 114.52,88.58 114.63,88.64 114.75,88.7 114.86,88.76 114.97,88.82 115.09,88.88 115.2,88.94 115.32,89 115.49,89.08 115.66,89.16 115.83,89.23 116,89.3 116.17,89.38 116.33,89.45 116.5,89.52 116.65,89.59 116.8,89.65 116.95,89.71 117.1,89.78 117.25,89.84 117.4,89.91 117.55,89.97 117.71,90.05 117.88,90.12 118.05,90.2 118.22,90.28 118.39,90.36 118.55,90.44 118.7,90.54 118.83,90.63 118.95,90.73 119.06,90.83 119.18,90.93 119.29,91.03 119.41,91.14 119.51,91.25 119.65,91.42 119.78,91.6 119.9,91.78 120.02,91.98 120.13,92.17 120.23,92.37 120.34,92.57 120.44,93.11 K1.A15
  Bottom 0.5: v77.1,86.44 76.53,86.17 76.41,86.14 76.29,86.12 76.17,86.09 76.05,86.07 75.93,86.05 75.81,86.02 75.7,86.01 75.6,85.99 75.49,85.98 75.39,85.96 75.28,85.95 75.18,85.93 75.07,85.92 74.93,85.92 74.37,85.91 74.06,85.95 73.61,86.08 73.01,86.19 72.43,86.22 71.88,86.16 71.53,86.05 71.09,85.81 70.6,85.49 70.01,84.98 69.69,84.51 69.52,83.92 69.52,83.39 69.6,82.63 69.84,81.92 70.16,81.21 70.57,80.5 70.94,79.99 71.36,79.6 72.16,79.06 73.77,78.5 75.11,77.64 76.14,76.86 77.14,75.83 77.8,74.95 78.27,74.14 78.68,73.21 79.07,72.11 79.36,70.84 79.49,69.84 79.5,37.84 79.51,30.64 79.42,29.87 79.32,29.09 79.27,28.85 79.22,28.6 79.19,28.47 79.16,28.34 79.13,28.2 79.09,28.07 79.06,27.93 79.02,27.8 78.99,27.67 78.94,27.51 78.89,27.36 78.84,27.21 78.78,27.05 78.73,26.9 78.67,26.75 78.62,26.6 78.56,26.44 78.5,26.29 78.44,26.13 78.38,25.98 78.32,25.83 78.25,25.67 78.18,25.53 78.1,25.37 78.01,25.21 77.91,25.06 77.81,24.91 77.71,24.76 77.61,24.61 77.52,24.45 77.43,24.32 77.34,24.19 77.25,24.06 77.16,23.93 77.07,23.8 76.98,23.67 76.88,23.55 76.78,23.45 76.68,23.34 76.57,23.24 76.47,23.14 76.36,23.04 76.25,22.94 76.14,22.85 75.97,22.72 75.8,22.59 75.63,22.47 75.45,22.35 75.27,22.24 75.09,22.12 74.91,22.01 74.76,21.93 74.61,21.85 74.47,21.77 74.32,21.7 74.17,21.62 74.02,21.55 73.87,21.48 IC3.20
/M1  (via drill 0.9)
  Top 0.5: K1.A22 137.74,92.63 137.43,92.16 136.47,91.52 135.2,91.04 133.77,90.57 132.19,89.93 130.6,89.14 128.54,88.03 127.11,87.07 125.68,85.49 123.93,83.42 122.5,81.52 121.07,79.77 119.17,77.39 117.74,75.96 116.79,75.17 116.08,74.83 115.41,74.64 114.38,74.52 113.15,74.5 107.56,74.73 105.27,74.88 102.36,75.22 101.14,75.37 100.7,75.45 100.32,75.54 99.81,75.75 99.16,76.07 98.73,76.41 98.35,76.81 97.84,77.26 97.15,77.86 96.55,78.22 95.79,78.55 94.81,78.66 92.33,78.78 91.01,78.72 89.79,78.59 88.77,78.35 88.29,78.08 v87.55,77.45 86.51,76.77 85.76,76.31 84.9,76.07 83.57,75.97 82.59,75.89 80.77,75.83 78.49,75.89 75.12,76.16 72.32,76.64 68.59,77.6 64.81,78.65 63.45,79.02 61.77,79.68 60.78,80.18 60.24,80.57 59.77,81.03 59.55,81.39 59.28,81.93 58.94,82.67 58.44,83.42 58.1,83.75 57.52,84.11 55.22,85.5 54.24,86.05 53.01,86.46 51.61,86.74 49.47,86.87 46.63,86.95 43.69,86.92 42.61,86.67 41.78,86.15 41.13,85.62 40.89,85.21 40.59,84.5 40.12,83.18 39.8,81.89 39.5,80.52 39.17,78.96 38.64,77.05 37.89,74.63 37.08,72.54 36.53,71.31 35.79,70.02 34.7,68.39 33.71,66.99 33.09,66.3 32.47,65.84 31.87,65.58 31.03,65.39 IC1.10
  Bottom 0.5: IC3.27 87.75,37.29 87.23,38.27 86.69,39.57 86.18,41.57 85.94,43.8 85.86,45.44 85.86,70.81 85.98,72.69 86.16,74.03 86.42,75.12 86.81,76.22 87.12,76.78 v87.55,77.45
/MREQ  (via drill 0.9)
  Top 0.5: IC1.9 29.6,68.18 29.48,68.31 29.37,68.44 29.26,68.58 29.15,68.72 29.05,68.85 28.94,68.99 28.84,69.13 28.71,69.34 28.58,69.55 28.46,69.77 28.34,69.98 28.22,70.2 28.11,70.42 28.01,70.65 27.91,70.9 27.83,71.16 27.75,71.42 27.68,71.68 27.61,71.94 27.55,72.21 27.49,72.47 27.45,72.73 27.41,72.98 27.38,73.24 27.36,73.5 27.33,73.75 27.31,74.01 27.29,74.27 27.27,74.53 27.26,74.79 27.24,75.05 27.23,75.31 27.22,75.57 27.21,75.84 27.21,76.1 27.21,76.32 27.22,76.55 27.23,76.78 27.23,77.01 27.25,77.24 27.26,77.46 27.29,77.69 27.34,77.95 27.4,78.22 27.47,78.48 27.54,78.74 27.61,79 27.69,79.26 27.77,79.52 27.85,79.77 27.93,80.03 28.02,80.28 28.11,80.53 28.2,80.78 28.3,81.03 28.4,81.27 28.45,81.37 28.49,81.47 28.54,81.58 28.58,81.69 28.63,81.79 28.69,81.88 28.76,81.95 28.81,81.97 28.86,82 28.92,82.02 28.97,82.03 29.03,82.05 29.08,82.06 29.21,82.08 29.34,82.07 29.47,82.05 29.6,82.02 29.73,81.99 29.86,81.97 30,81.95 30.19,81.93 30.38,81.9 30.58,81.88 30.77,81.86 30.96,81.85 31.16,81.83 31.35,81.83 31.49,81.83 31.63,81.83 31.78,81.83 31.92,81.83 32.06,81.84 32.2,81.85 32.34,81.87 32.51,81.9 32.68,81.95 32.85,82.01 33.01,82.06 33.18,82.13 33.34,82.19 33.5,82.26 33.69,82.37 33.87,82.48 34.05,82.61 34.22,82.74 34.4,82.87 34.57,83 34.73,83.14 34.89,83.29 35.03,83.44 35.18,83.6 35.32,83.76 35.46,83.92 35.6,84.09 35.73,84.25 35.91,84.53 36.08,84.81 36.24,85.1 36.39,85.39 36.55,85.69 36.69,85.99 36.84,86.28 36.95,86.51 37.05,86.75 37.14,86.98 37.24,87.22 37.34,87.46 37.44,87.69 37.56,87.91 37.67,88.13 37.8,88.34 37.93,88.54 38.06,88.75 38.19,88.95 38.33,89.15 38.47,89.35 38.65,89.58 38.84,89.8 39.04,90.03 39.24,90.24 39.44,90.46 39.65,90.66 39.87,90.86 40.1,91.04 40.35,91.22 40.6,91.38 40.86,91.55 41.12,91.7 41.38,91.84 41.66,91.97 41.92,92.07 42.19,92.16 42.46,92.24 42.73,92.31 43.01,92.38 43.29,92.44 43.56,92.49 43.89,92.54 44.22,92.57 44.55,92.59 44.88,92.61 45.21,92.62 45.55,92.62 45.87,92.61 46.16,92.59 46.46,92.55 46.75,92.5 47.04,92.46 47.33,92.41 47.62,92.35 47.9,92.29 48.23,92.21 48.56,92.12 48.88,92.02 49.2,91.92 49.53,91.82 49.85,91.72 50.17,91.62 50.63,91.47 51.1,91.32 51.56,91.17 52.02,91.02 52.48,90.87 52.94,90.71 53.39,90.54 53.95,90.31 54.5,90.06 55.05,89.81 55.59,89.55 56.13,89.28 56.67,89.02 57.21,88.75 57.6,88.55 57.99,88.35 58.38,88.14 58.76,87.93 59.14,87.72 59.53,87.52 59.92,87.32 60.12,87.22 60.32,87.12 60.51,87.02 61.12,86.76 61.92,86.52 62.74,86.37 63.52,86.32 67.1,86.32 68.15,86.41 69.05,86.54 70.17,86.8 70.89,86.95 71.48,87.03 73.66,87.05 74.01,87.08 v74.56,87.23 75.25,87.81 75.36,87.88 75.46,87.92 75.56,87.96 75.66,88 75.76,88.03 75.87,88.06 75.97,88.09 76.08,88.11 76.22,88.13 76.36,88.14 76.5,88.14 76.64,88.14 76.79,88.14 76.93,88.13 77.07,88.11 77.2,88.09 77.33,88.06 77.47,88.03 77.6,87.99 77.73,87.95 77.86,87.91 77.99,87.88 78.17,87.82 78.35,87.76 78.53,87.69 78.71,87.63 78.89,87.56 79.08,87.5 79.26,87.44 79.41,87.39 79.56,87.34 79.72,87.29 79.87,87.25 80.03,87.2 80.18,87.16 80.33,87.12 80.62,87.06 80.92,87.01 81.22,86.97 81.51,86.94 81.81,86.91 82.11,86.88 82.4,86.84 82.73,86.8 83.06,86.77 83.39,86.74 83.72,86.7 84.05,86.67 84.38,86.64 84.71,86.6 85.33,86.53 85.94,86.46 86.55,86.38 87.17,86.31 87.78,86.24 88.39,86.17 89.01,86.12 89.31,86.11 89.61,86.1 89.91,86.09 90.21,86.08 90.52,86.07 90.82,86.06 91.12,86.05 91.49,86.02 91.87,86 92.24,85.97 92.62,85.94 92.99,85.92 93.37,85.9 93.74,85.89 94.08,85.88 94.43,85.89 94.77,85.9 95.11,85.9 95.45,85.91 95.79,85.92 96.13,85.93 96.38,85.93 96.62,85.94 96.87,85.94 97.11,85.95 97.36,85.96 97.6,85.95 97.84,85.93 98.08,85.88 98.33,85.82 98.56,85.75 98.8,85.67 99.04,85.59 99.28,85.52 99.51,85.45 99.8,85.36 100.08,85.28 100.37,85.19 100.65,85.11 100.94,85.02 101.22,84.94 101.5,84.85 101.79,84.77 102.07,84.68 102.35,84.58 102.64,84.49 102.92,84.41 103.2,84.34 103.49,84.29 103.75,84.28 104.01,84.28 104.28,84.3 104.54,84.32 104.8,84.34 105.07,84.37 105.32,84.41 105.57,84.47 105.82,84.53 106.07,84.6 106.31,84.67 106.56,84.75 106.8,84.84 107.03,84.93 107.25,85.03 107.47,85.15 107.68,85.26 107.89,85.38 108.1,85.51 108.3,85.64 108.51,85.77 108.69,85.89 108.87,86.02 109.04,86.15 109.22,86.28 109.39,86.42 109.56,86.55 109.74,86.68 109.93,86.82 110.11,86.96 110.3,87.09 110.49,87.23 110.67,87.37 110.86,87.5 111.05,87.64 111.19,87.73 111.34,87.82 111.48,87.91 111.62,88 111.76,88.09 111.91,88.18 112.05,88.27 112.29,88.42 112.53,88.56 112.78,88.7 113.03,88.84 113.27,88.98 113.52,89.12 113.76,89.27 113.97,89.4 114.17,89.53 114.37,89.66 114.58,89.79 114.78,89.93 114.99,90.06 115.19,90.18 115.38,90.29 115.57,90.4 115.76,90.5 115.95,90.6 116.14,90.71 116.33,90.82 116.51,90.94 116.73,91.11 116.96,91.28 117.19,91.46 117.41,91.65 117.62,91.84 117.8,92.06 117.94,92.29 117.96,92.35 117.98,92.41 118,92.47 118.02,92.53 118.04,92.59 118.06,92.65 K1.A14
  Bottom 0.5: IC3.19 74.65,24.65 75.31,25.14 76.24,25.97 76.92,26.66 77.68,27.73 78,28.44 78.22,29.27 78.36,30.06 78.51,31.3 78.58,32.62 78.59,37.69 78.58,68.82 78.49,69.97 78.37,70.92 78.12,71.91 77.81,72.77 77.3,73.89 76.88,74.62 76.27,75.4 75.83,75.86 75.4,76.25 74.13,77.15 71.64,78.31 71.04,78.68 70.6,79.04 70.21,79.48 69.9,79.9 69.46,80.65 69.11,81.36 68.87,82.01 68.83,82.13 68.79,82.25 68.76,82.38 68.73,82.51 68.7,82.65 68.68,82.79 68.66,82.93 68.65,83.07 68.63,83.21 68.62,83.35 68.62,83.48 68.62,83.61 68.62,83.74 68.62,83.87 68.63,84 68.64,84.12 68.66,84.25 68.68,84.37 68.71,84.49 68.74,84.6 68.77,84.72 68.8,84.83 68.84,84.95 68.89,85.05 68.95,85.16 69.02,85.27 69.1,85.37 69.18,85.47 69.26,85.57 69.34,85.66 69.43,85.76 69.5,85.83 69.58,85.9 69.66,85.97 69.75,86.03 69.83,86.1 69.91,86.16 70,86.22 70.09,86.29 70.19,86.35 70.29,86.41 70.39,86.46 70.5,86.52 70.6,86.57 70.7,86.63 70.81,86.68 70.92,86.74 71.03,86.79 71.98,87.09 72.69,87.25 v74.56,87.23
/NMI  (via drill 0.9)
  Top 0.5: 41.33,93.69 41.2,93.65 41.08,93.6 40.96,93.56 40.84,93.51 40.71,93.46 40.59,93.41 40.47,93.36 40.3,93.28 40.12,93.18 39.95,93.08 39.78,92.98 39.61,92.88 39.44,92.78 39.27,92.68 39.06,92.55 38.85,92.42 38.64,92.29 38.44,92.16 38.23,92.02 38.03,91.89 37.82,91.75 37.7,91.64 37.57,91.53 37.44,91.42 37.31,91.31 37.18,91.2 37.05,91.08 36.92,90.97 36.75,90.82 36.57,90.66 36.4,90.51 36.22,90.35 36.05,90.2 35.87,90.04 35.7,89.88 35.52,89.73 35.35,89.57 35.18,89.41 35.01,89.25 34.84,89.1 34.67,88.94 34.49,88.8 34.27,88.63 34.06,88.48 33.84,88.33 33.61,88.18 33.38,88.04 33.16,87.9 32.93,87.75 32.74,87.63 32.56,87.52 32.38,87.4 32.19,87.3 32,87.2 31.8,87.12 31.6,87.05 31.51,87.02 31.41,87 31.32,86.97 31.23,86.96 31.13,86.94 31.03,86.92 30.94,86.9 30.62,86.86 30.3,86.84 29.98,86.83 29.66,86.84 29.34,86.85 29.02,86.88 28.69,86.9 v28.05,86.92 | 41.33,93.69 41.48,93.75 41.63,93.8 41.78,93.84 41.93,93.89 42.08,93.94 42.24,93.98 42.39,94.03 42.59,94.06 42.78,94.09 42.98,94.12 43.17,94.14 43.37,94.17 43.57,94.19 43.76,94.21 43.95,94.23 44.15,94.24 44.34,94.25 44.53,94.26 44.73,94.27 44.92,94.28 45.11,94.28 45.28,94.29 45.46,94.3 45.63,94.31 45.8,94.32 45.97,94.33 46.15,94.33 46.32,94.33 46.52,94.32 46.73,94.31 46.94,94.3 47.14,94.28 47.35,94.26 47.56,94.24 47.76,94.21 47.98,94.18 48.2,94.14 48.42,94.1 48.64,94.05 48.86,94.01 49.08,93.96 49.3,93.91 49.53,93.85 49.76,93.79 49.98,93.73 50.21,93.66 50.44,93.6 50.66,93.53 50.88,93.46 51.2,93.35 51.52,93.23 51.83,93.11 52.14,92.98 52.45,92.85 52.75,92.72 53.06,92.58 53.36,92.46 53.66,92.34 53.96,92.22 54.27,92.1 54.57,91.97 54.87,91.85 55.17,91.73 55.45,91.61 55.74,91.5 56.02,91.38 56.3,91.26 56.59,91.14 56.87,91.02 57.16,90.9 60.38,89.34 60.65,89.2 60.92,89.07 61.2,88.93 61.47,88.8 61.75,88.68 62.03,88.56 62.27,88.47 62.5,88.37 63.19,88.19 63.86,88.12 67.42,88.12 67.95,88.15 68.42,88.24 69.19,88.41 69.41,88.49 69.62,88.56 69.82,88.62 70.03,88.69 70.24,88.75 70.45,88.82 70.65,88.89 70.86,88.96 71.15,89.08 71.43,89.21 71.72,89.34 72,89.47 v72.81,89.77 73.55,90.59 73.66,90.68 73.77,90.75 73.89,90.83 74,90.9 74.12,90.97 74.24,91.05 74.36,91.11 74.47,91.16 74.59,91.2 74.71,91.24 74.83,91.27 74.94,91.31 75.06,91.33 75.19,91.35 75.31,91.36 75.43,91.37 75.56,91.37 75.68,91.36 75.81,91.35 75.93,91.34 76.06,91.33 76.18,91.27 76.3,91.22 76.42,91.16 76.55,91.1 76.66,91.04 76.78,90.97 76.89,90.9 77.02,90.8 77.15,90.69 77.27,90.57 77.39,90.46 77.51,90.34 77.63,90.22 77.76,90.12 77.92,90.01 78.08,89.91 78.25,89.81 78.41,89.71 78.58,89.61 78.75,89.52 78.92,89.43 79.14,89.34 79.37,89.26 79.6,89.19 79.83,89.12 80.07,89.06 80.3,89 80.53,88.94 80.78,88.88 81.03,88.83 81.29,88.78 81.54,88.73 81.8,88.69 82.05,88.65 82.31,88.61 82.5,88.58 82.7,88.55 82.9,88.53 83.1,88.51 83.3,88.49 83.5,88.46 83.7,88.44 83.96,88.41 84.22,88.38 84.48,88.35 84.74,88.32 85,88.29 85.26,88.26 85.52,88.23 85.76,88.19 85.99,88.15 86.22,88.12 86.46,88.08 86.69,88.05 86.92,88.02 87.16,87.99 87.42,87.97 87.68,87.95 87.94,87.93 88.2,87.92 88.46,87.9 88.72,87.89 88.98,87.87 89.44,87.84 89.89,87.81 90.35,87.78 90.8,87.75 91.26,87.73 91.72,87.7 92.17,87.68 92.55,87.67 92.94,87.67 93.32,87.67 93.7,87.66 94.08,87.66 94.47,87.66 94.85,87.66 95.18,87.66 95.52,87.66 95.85,87.66 96.19,87.67 96.52,87.67 96.86,87.67 97.19,87.66 97.35,87.66 97.51,87.65 97.68,87.65 97.84,87.64 98,87.64 98.16,87.63 98.33,87.61 98.54,87.58 98.75,87.54 98.96,87.49 99.17,87.44 99.37,87.38 99.58,87.33 99.79,87.28 100.03,87.22 100.27,87.16 100.5,87.09 100.74,87.02 100.97,86.95 101.21,86.89 101.45,86.83 101.65,86.79 101.85,86.75 102.05,86.71 102.26,86.67 102.46,86.63 102.66,86.6 102.87,86.57 103.11,86.55 103.35,86.53 103.6,86.53 103.84,86.52 104.08,86.52 104.33,86.52 104.57,86.52 104.76,86.53 104.95,86.55 105.13,86.56 105.32,86.58 105.51,86.6 105.69,86.63 105.87,86.67 106.13,86.75 106.37,86.87 106.61,87 106.85,87.13 107.09,87.27 107.32,87.42 107.55,87.56 107.76,87.71 107.96,87.86 108.15,88.02 108.34,88.18 108.54,88.34 108.73,88.5 108.92,88.65 109.16,88.84 109.39,89.03 109.62,89.23 109.85,89.42 110.08,89.61 110.31,89.81 110.53,90 110.71,90.15 110.88,90.31 111.05,90.46 111.22,90.61 111.39,90.76 111.57,90.92 111.74,91.07 111.86,91.17 111.98,91.27 112.1,91.36 112.23,91.46 112.35,91.56 112.46,91.66 112.57,91.94 112.66,92.47 K1.A12
  Top 0.5: 41.33,93.69 41.5,93.81 41.67,93.94 41.84,94.06 42.01,94.2 42.16,94.33 42.3,94.48 42.44,94.64 42.48,94.7 42.53,94.77 42.58,94.84 42.62,94.91 42.66,94.97 42.7,95.04 42.74,95.11 42.82,95.26 42.89,95.41 42.96,95.56 43.02,95.71 43.08,95.87 43.14,96.02 43.2,96.18 43.25,96.33 43.3,96.49 43.34,96.65 43.39,96.81 43.43,96.97 43.47,97.13 43.5,97.29 43.52,97.41 43.53,97.53 43.54,97.65 43.55,97.78 43.56,97.9 43.57,98.02 43.57,98.14 43.58,98.24 T1.3
  Bottom 0.5: v28.05,86.92 28.38,86.27 28.39,86.22 28.4,86.18 28.41,86.14 28.43,86.09 28.44,86.05 28.45,86 28.48,85.87 28.51,85.74 28.54,85.6 28.57,85.47 28.6,85.33 28.63,85.2 28.65,85.06 28.66,84.94 28.68,84.82 28.69,84.69 28.7,84.57 28.71,84.44 28.72,84.32 28.72,84.19 28.7,84.07 28.68,83.94 28.65,83.82 28.61,83.7 28.58,83.57 28.55,83.45 28.52,83.32 28.48,83.2 28.44,83.08 28.4,82.95 28.36,82.83 28.32,82.71 28.28,82.58 28.25,82.46 28.22,82.3 28.2,82.15 28.18,82 28.16,81.84 28.14,81.69 28.13,81.54 28.11,81.38 28.1,81.08 28.09,80.77 28.09,80.47 28.1,80.16 28.11,79.85 28.11,79.55 28.11,79.24 28.11,78.63 28.1,78.02 28.09,77.41 28.07,76.8 28.06,76.18 28.05,75.57 28.05,74.96 28.04,74.37 28.04,73.77 28.04,73.18 28.04,72.59 28.04,72 28.05,71.4 28.05,70.81 28.05,58.9 28.05,58.59 28.04,58.29 28.04,57.98 28.04,57.67 28.04,57.37 28.04,57.06 28.05,56.76 28.05,56.56 28.06,56.35 28.06,56.15 28.07,55.95 28.07,55.75 28.09,55.55 28.11,55.35 28.14,55.2 28.17,55.04 28.21,54.89 28.25,54.73 28.29,54.58 28.33,54.43 28.38,54.28 28.44,54.14 28.49,54 28.56,53.86 28.62,53.72 28.69,53.59 28.76,53.46 28.85,53.34 28.95,53.24 29.06,53.14 29.18,53.05 29.31,52.97 29.45,52.89 29.58,52.81 29.72,52.74 IC1.15 | IC3.17 73.83,29.27 73.91,29.31 73.98,29.34 74.05,29.38 74.12,29.41 74.2,29.44 74.27,29.47 74.36,29.51 74.46,29.55 74.56,29.59 74.66,29.62 74.75,29.66 74.85,29.7 74.94,29.74 75.06,29.81 75.17,29.89 75.28,29.98 75.4,30.06 75.5,30.15 75.61,30.25 75.71,30.34 75.78,30.43 75.85,30.53 75.92,30.62 75.99,30.72 76.05,30.81 76.12,30.91 76.18,31.01 76.24,31.14 76.3,31.27 76.36,31.41 76.41,31.54 76.46,31.68 76.5,31.81 76.54,31.95 76.57,32.08 76.6,32.21 76.61,32.34 76.68,33.07 76.67,37.69 76.67,68.56 76.61,69.55 76.5,70.43 76.28,71.14 75.93,72.01 75.62,72.65 75.16,73.5 74.53,74.3 73.72,74.98 72.67,75.68 70.6,76.51 69.82,77.05 69.22,77.61 68.75,78.19 68.17,79.12 67.65,80.11 67.36,80.92 67.12,81.7 67.06,81.9 67.01,82.09 66.96,82.28 66.92,82.48 66.89,82.68 66.86,82.88 66.84,83.08 66.83,83.28 66.82,83.48 66.81,83.68 66.82,83.88 66.83,84.06 66.86,84.24 66.88,84.41 66.91,84.59 66.95,84.77 66.98,84.95 67.02,85.12 67.05,85.28 67.09,85.43 67.13,85.59 67.17,85.74 67.21,85.89 67.26,86.05 67.32,86.19 67.38,86.32 67.45,86.45 67.53,86.58 67.6,86.7 67.68,86.83 67.77,86.95 67.86,87.06 67.97,87.18 68.08,87.3 68.21,87.41 68.34,87.52 68.47,87.62 68.59,87.73 68.72,87.83 68.8,87.89 68.89,87.95 68.97,88 69.05,88.06 69.13,88.12 69.21,88.17 69.29,88.23 70.71,89 71.9,89.49 v72.81,89.77
/RAMCS  (via drill 0.9)
  Top 0.5: 91.64,90.06 91.32,90.11 91.01,90.12 90.73,90.1 90.65,90.08 90.57,90.06 90.5,90.04 90.42,90.01 90.34,89.99 90.26,89.96 90.19,89.93 90.07,89.88 89.96,89.83 89.84,89.78 89.73,89.74 89.61,89.7 89.5,89.67 89.38,89.65 89.25,89.63 89.13,89.63 89,89.63 88.87,89.63 88.74,89.64 88.61,89.65 88.48,89.65 88.15,89.65 87.82,89.66 87.49,89.67 87.16,89.68 86.82,89.69 86.49,89.71 86.16,89.74 85.84,89.78 85.51,89.84 85.19,89.9 84.86,89.96 84.54,90.02 84.22,90.09 83.89,90.14 83.65,90.19 83.41,90.23 83.16,90.28 82.92,90.32 82.67,90.36 82.43,90.41 82.19,90.45 81.95,90.5 81.71,90.55 81.47,90.59 81.23,90.65 81,90.71 80.76,90.78 80.53,90.85 80.39,90.91 80.26,90.96 80.12,91.01 79.98,91.07 79.85,91.13 79.72,91.19 79.58,91.26 79.37,91.38 79.16,91.53 78.96,91.68 78.75,91.84 78.55,92 78.35,92.15 78.14,92.3 77.93,92.44 77.72,92.59 77.52,92.74 77.31,92.88 77.1,93.02 76.88,93.14 76.65,93.24 76.48,93.3 76.3,93.34 76.12,93.38 75.94,93.41 75.76,93.44 75.58,93.46 75.4,93.48 75.22,93.48 75.05,93.48 74.87,93.46 74.69,93.45 74.52,93.43 74.34,93.42 74.17,93.41 73.99,93.4 73.81,93.4 73.64,93.39 73.46,93.39 73.29,93.39 73.11,93.39 72.94,93.41 72.78,93.44 72.61,93.47 72.45,93.5 72.29,93.54 72.13,93.58 71.56,93.76 70.85,94.13 69.98,94.76 69.34,95.4 68.81,96.15 68.36,96.81 67.61,97.66 67.01,98.17 66.35,98.61 65.66,98.95 65.06,99.14 63.97,99.26 62.82,99.27 54.93,99.29 53.87,99.24 53.35,99.16 52.82,99.04 52.41,98.94 52.11,98.82 51.65,98.5 51.44,98.31 51.22,98.12 51,97.93 50.8,97.76 50.59,97.59 50.38,97.42 50.17,97.25 49.96,97.08 49.75,96.91 49.54,96.75 R2.2